# EAGLE design boardfix (EAGLE 9.6.0)
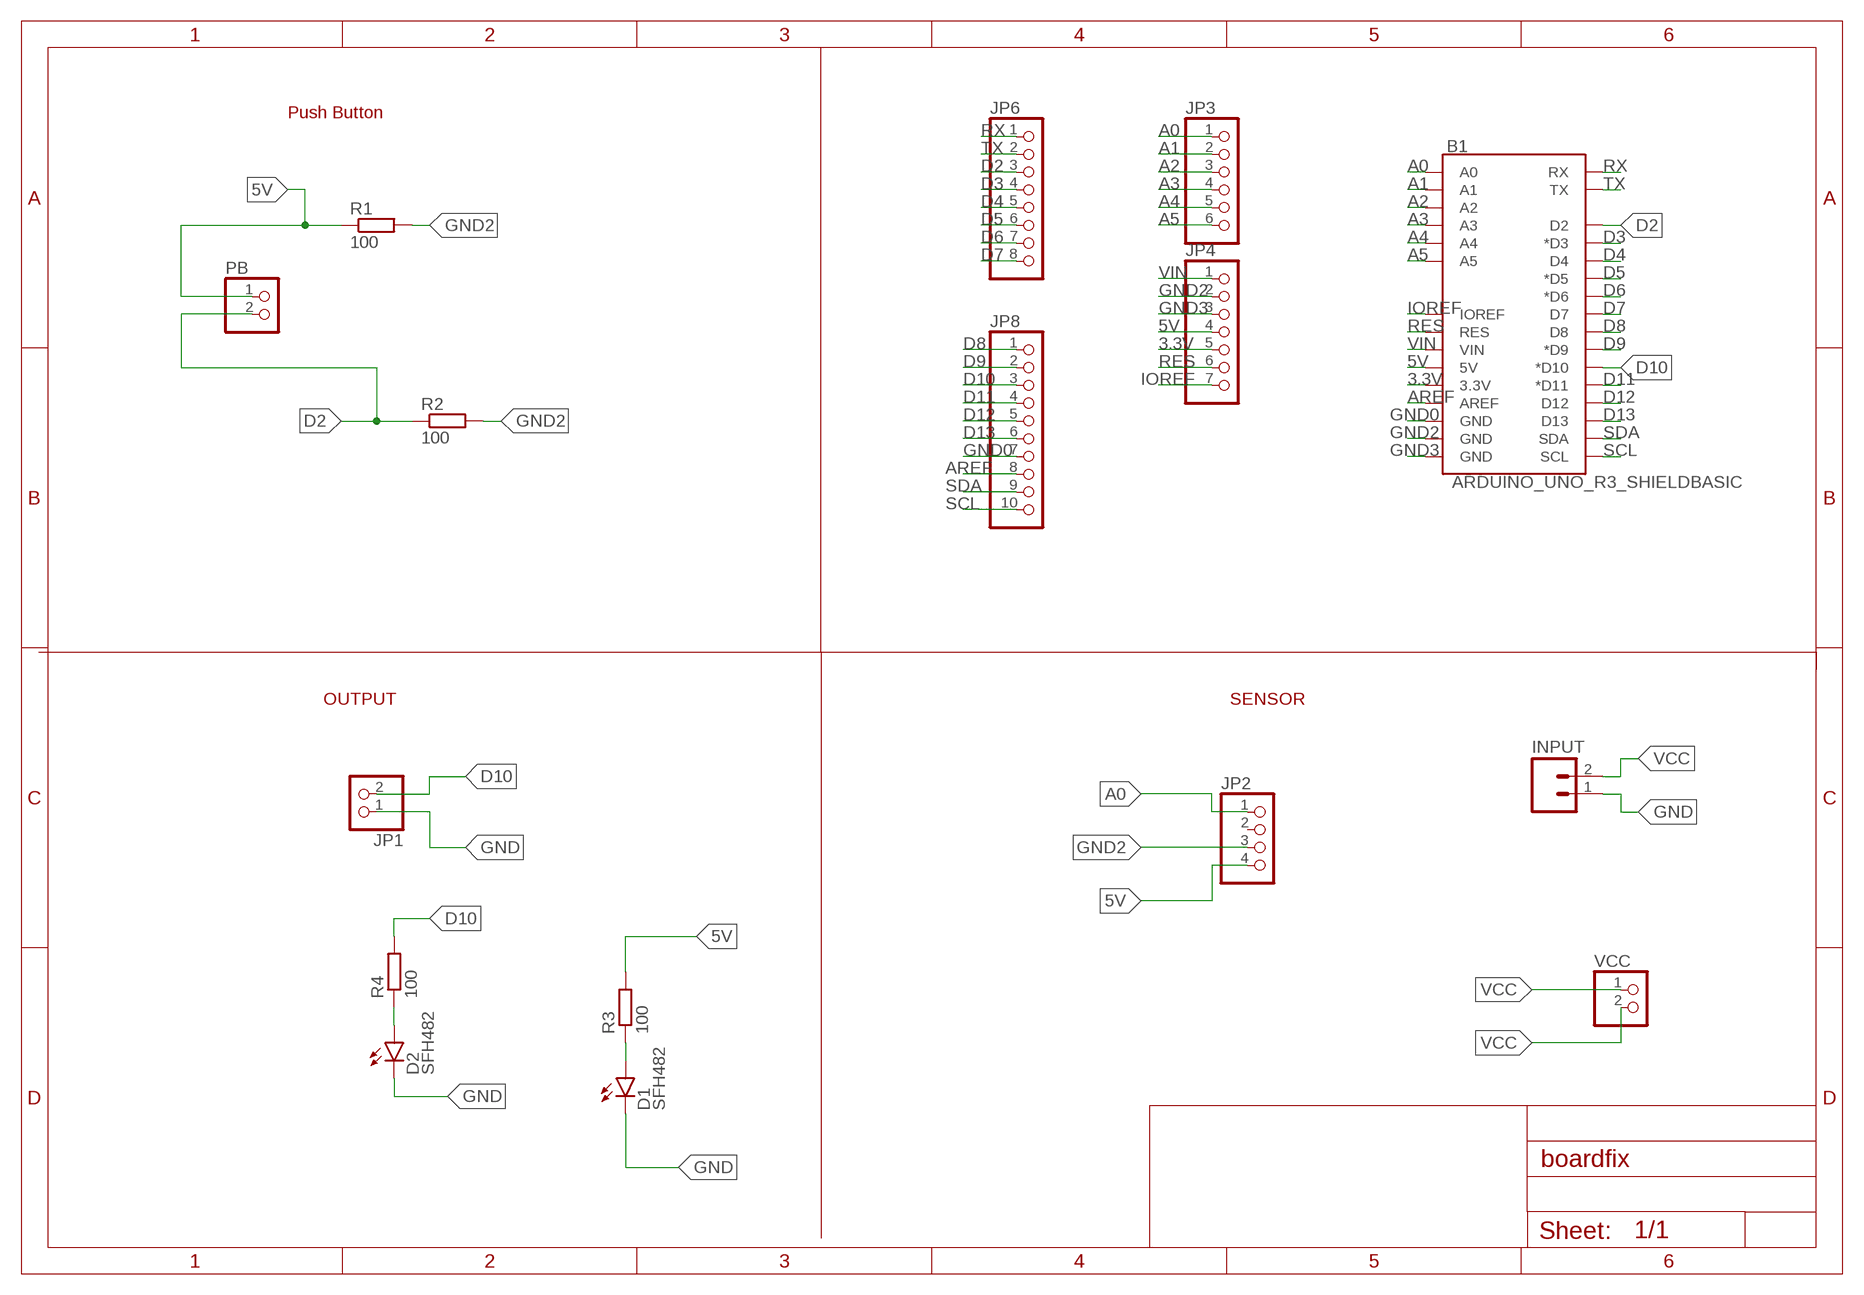
[diagram p0: schematic, sheet 1]

## Parts
B1  ARDUINO_UNO_R3_SHIELDBASIC  [UNO_R3_SHIELD]
D1  SFH482  [SFH482]
D2  SFH482  [SFH482]
INPUT  M02  [02P]
JP1  PINHD-1X2  [1X02]
JP2  PINHD-1X4  [1X04]
JP3  PINHD-1X6  [1X06]
JP4  PINHD-1X7  [1X07]
JP6  PINHD-1X8  [1X08]
JP8  PINHD-1X10  [1X10]
PB  PINHD-1X2  [1X02]
R1  100  R-EU_0207/7  [0207/7]
R2  100  R-EU_0207/7  [0207/7]
R3  100  R-EU_0207/7  [0207/7]
R4  100  R-EU_0207/7  [0207/7]
VCC  PINHD-1X2  [1X02]

## Nets
3.3V: B1.3.3V JP4.5
5V: B1.5V JP2.4 JP4.4 PB.1 R1.1 R3.2
A0: B1.A0 JP2.1 JP3.1
A1: B1.A1 JP3.2
A2: B1.A2 JP3.3
A3: B1.A3 JP3.4
A4: B1.A4 JP3.5
A5: B1.A5 JP3.6
AREF: B1.AREF JP8.8
D2: B1.D2 JP6.3 PB.2 R2.1
D3: B1.D3(*D3) JP6.4
D4: B1.D4 JP6.5
D5: B1.D5(*D5) JP6.6
D6: B1.D6(*D6) JP6.7
D7: B1.D7 JP6.8
D8: B1.D8 JP8.1
D9: B1.D9(*D9) JP8.2
D10: B1.D10(*D10) JP1.2 JP8.3 R4.2
D11: B1.D11(*D11) JP8.4
D12: B1.D12 JP8.5
D13: B1.D13 JP8.6
GND: D1.K(C) D2.K(C) INPUT.1 JP1.1
GND0: B1.GND@2(GND) JP8.7
GND2: B1.GND@1(GND) JP2.3 JP4.2 R1.2 R2.2
GND3: B1.GND@0(GND) JP4.3
IOREF: B1.IOREF JP4.7
N$2: D1.A R3.1
N$7: D2.A R4.1
RES: B1.RES JP4.6
RX: B1.RX JP6.1
SCL: B1.SCL JP8.10
SDA: B1.SDA JP8.9
TX: B1.TX JP6.2
VCC: INPUT.2 VCC.1 VCC.2
VIN: B1.VIN JP4.1
Unconnected: JP2.2

## Notes on the sheet
- Push Button
- OUTPUT | SENSOR

## Library data of the parts
B1 = SparkFun-Boards:ARDUINO_UNO_R3_SHIELD: Arduino R3 Shield Footprint Shield form compatible with the Arduino Uno R3. SparkFun Products: MG2639 Cellular Shield <https://www.sparkfun.com/products/13120> MIDI Shield <https://www.sparkfun.com/products/12898> R3 Stackable Headers Kit <https://www.sparkfun.com/products/11417>
D1 D2 = led:SFH482: IR LED infrared emitting diode, Infineon
INPUT = con-amp-quick:M02: AMP QUICK CONNECTOR; OC_FARNELL: unknown; OC_NEWARK: unknown
JP1 PB VCC = pinhead:PINHD-1X2: PIN HEADER
JP2 = pinhead:PINHD-1X4: PIN HEADER
JP3 = pinhead:PINHD-1X6: PIN HEADER
JP4 = pinhead:PINHD-1X7: PIN HEADER
JP6 = pinhead:PINHD-1X8: PIN HEADER
JP8 = pinhead:PINHD-1X10: PIN HEADER
R1-R4 = rcl:R-EU_: RESISTOR, European symbol; SPICEPREFIX: R

## Board
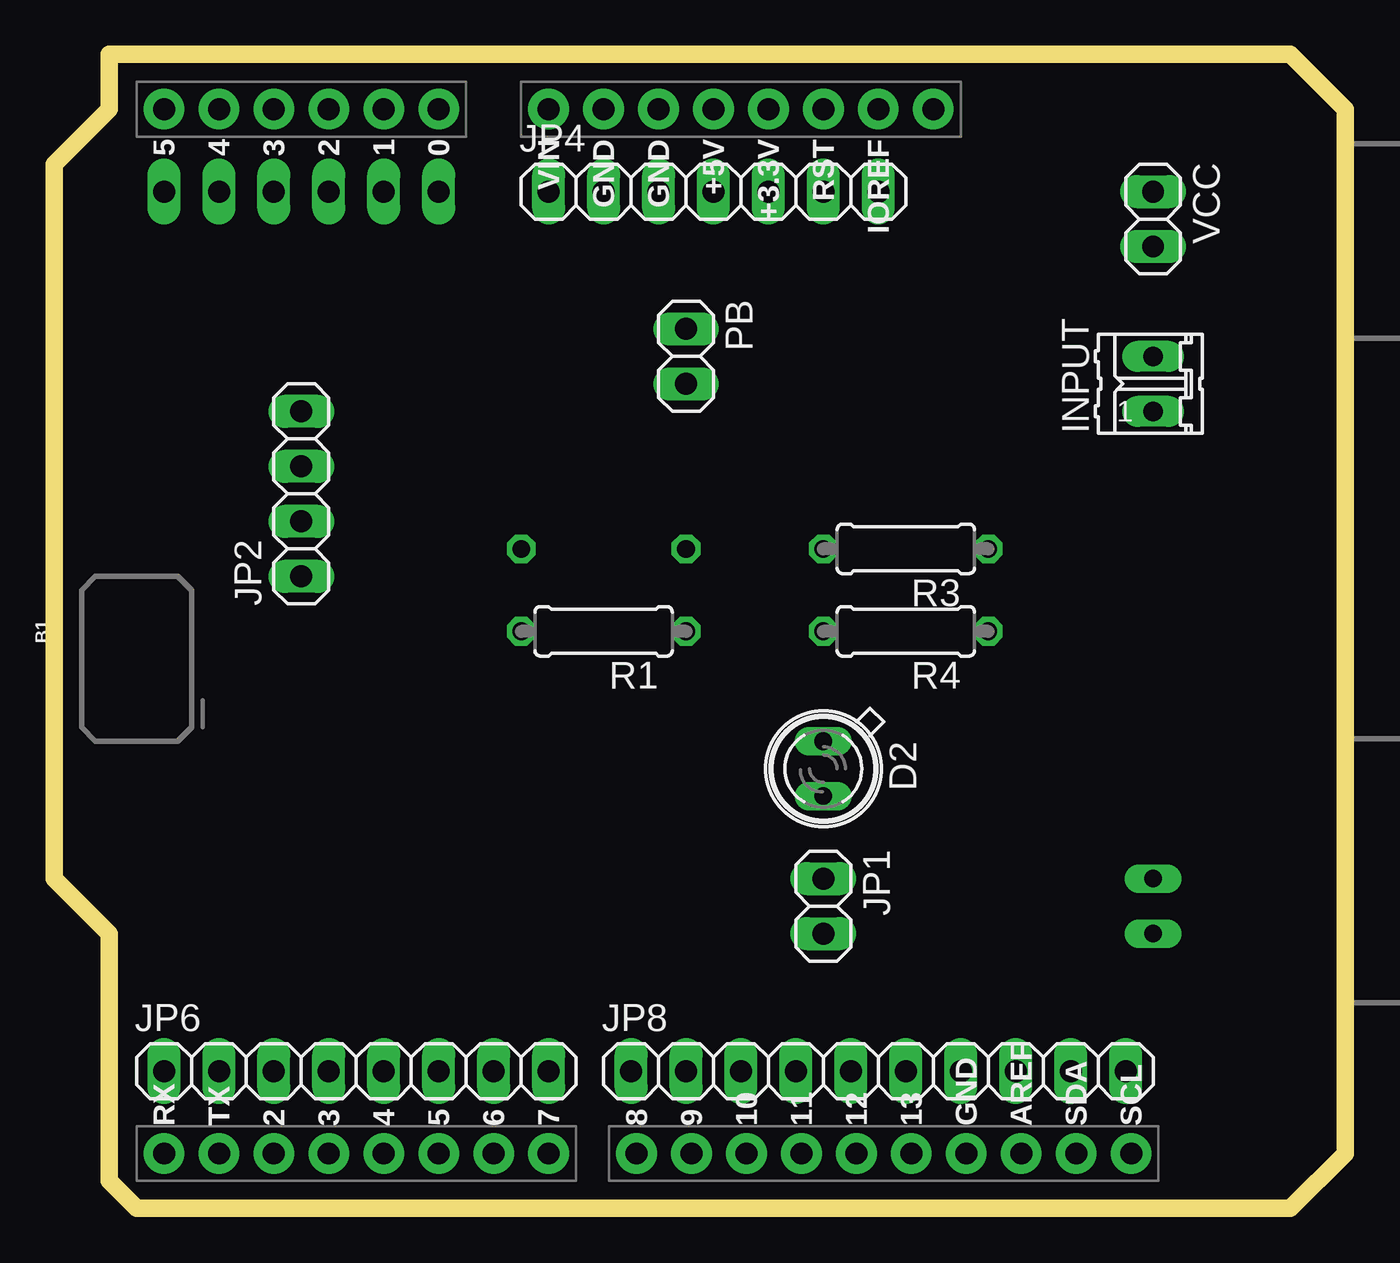
[diagram p1: board, top side]
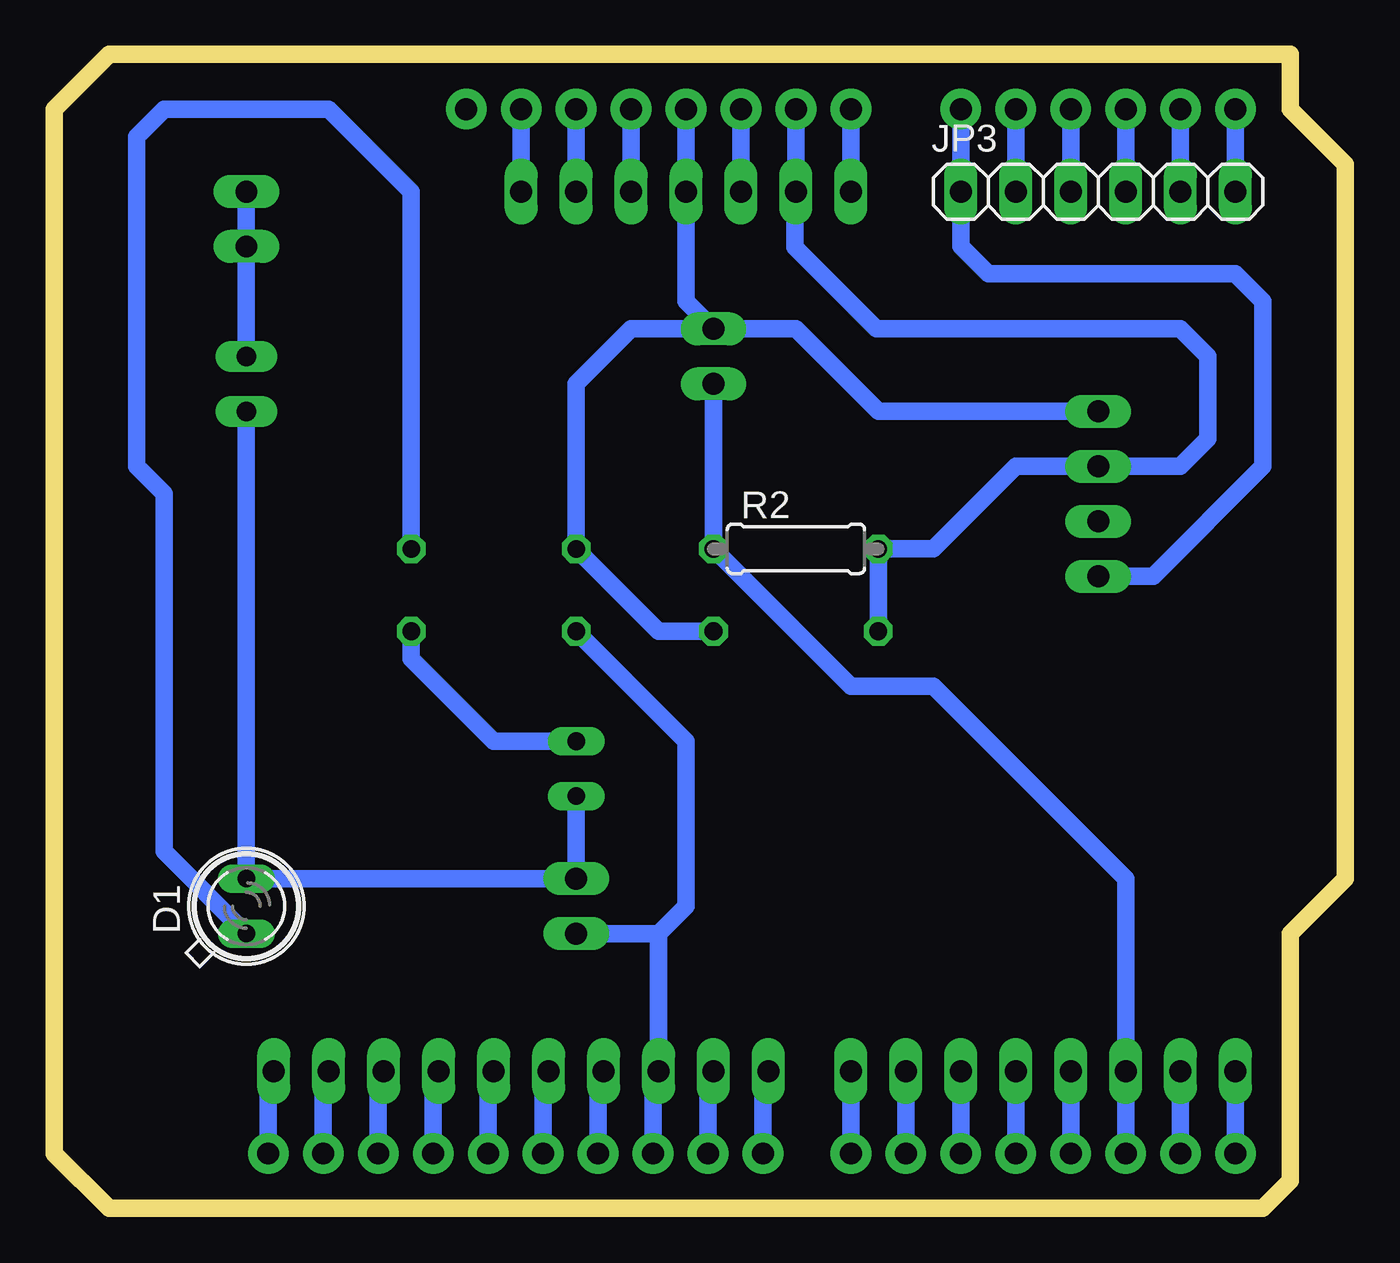
[diagram p2: board, bottom side, seen from below]

Size 59.69 x 53.34 mm. Coordinates in mm from the lower left corner, seen from the top.
Outline: 2.54,50.8 2.54,53.34 57.15,53.34 59.69,50.8 59.69,2.54 57.15,0 3.81,0 2.54,1.27 2.54,12.7 0,15.24 0,48.26 2.54,50.8
Copper layers (1*16): Top 0.035mm / dielectric 1.5mm / Bottom 0.035mm
Design rules "default": minimum track width 6mil, minimum drill 0.35mm, track to track 6mil, track to pad 6mil, pad to pad 6mil, via to via 6mil, smd to smd 6mil, copper to edge 40mil, drill to drill 6mil, minimum pad ring 10mil, minimum via ring 8mil, stop-mask expansion 4mil, vias tented up to drill 0mil, thermal gap 10mil

### Footprints (pad centres in the part's own frame; a part is rotated, then mirrored left to right if it is on the bottom)
UNO_R3_SHIELD = drill 1.016 pad 1.88: 3.3V 24.13,-2.54; 5V 24.13,0; A0 24.13,12.7; A1 24.13,15.24; A2 24.13,17.78; A3 24.13,20.32; A4 24.13,22.86; A5 24.13,25.4; AREF -24.13,-14.224; D2 -24.13,20.32; D3 -24.13,17.78; D4 -24.13,15.24; D5 -24.13,12.7; D6 -24.13,10.16; D7 -24.13,7.62; D8 -24.13,3.556; D9 -24.13,1.016; D10 -24.13,-1.524; D11 -24.13,-4.064; D12 -24.13,-6.604; D13 -24.13,-9.144; GND@0 24.13,2.54; GND@1 24.13,5.08; GND@2 -24.13,-11.684; IOREF 24.13,-7.62; NC 24.13,-10.16; RES 24.13,-5.08; RX -24.13,25.4; SCL -24.13,-19.304; SDA -24.13,-16.764; TX -24.13,22.86; VIN 24.13,7.62
SFH482 = drill 0.813 long: A -1.27,0; K 1.27,0
02P = drill 0.914 long: 1 -1.27,0; 2 1.27,0
1X02 = drill 1.016 long: 1 -1.27,0; 2 1.27,0
1X04 = drill 1.016 long: 1 -3.81,0; 2 -1.27,0; 3 1.27,0; 4 3.81,0
1X06 = drill 1.016 long: 1 -6.35,0; 2 -3.81,0; 3 -1.27,0; 4 1.27,0; 5 3.81,0; 6 6.35,0
1X07 = drill 1.016 long: 1 -7.62,0; 2 -5.08,0; 3 -2.54,0; 4 0,0; 5 2.54,0; 6 5.08,0; 7 7.62,0
1X08 = drill 1.016 long: 1 -8.89,0; 2 -6.35,0; 3 -3.81,0; 4 -1.27,0; 5 1.27,0; 6 3.81,0; 7 6.35,0; 8 8.89,0
1X10 = drill 1.016 long: 1 -11.43,0; 2 -8.89,0; 3 -6.35,0; 4 -3.81,0; 5 -1.27,0; 6 1.27,0; 7 3.81,0; 8 6.35,0; 9 8.89,0; 10 11.43,0
0207/7 = drill 0.813 octagon: 1 -3.81,0; 2 3.81,0

### Placement (x,y rotation side)
B1  30.48,26.67 90 top
D1  50.8,13.97 90 bottom
D2  35.56,20.32 270 top
INPUT  50.8,38.1 90 top
JP1  35.56,13.97 270 top
JP2  11.43,33.02 90 top
JP3  11.43,46.99 0 bottom
JP4  30.48,46.99 0 top
JP6  13.97,6.35 0 top
JP8  38.1,6.35 0 top
PB  29.21,39.37 270 top
R1  25.4,26.67 180 top
R2  25.4,30.48 0 bottom
R3  39.37,30.48 180 top
R4  39.37,26.67 180 top
VCC  50.8,45.72 270 top

### Tracks (layer width: path | path; a pad name or v marks a point on that pad's centre or on a via)
3.3V
  Bottom 0.813: JP4.5 B1.3.3V
5V
  Bottom 0.813: B1.5V JP4.4 30.48,41.91 PB.1 | PB.1 25.4,40.64 21.59,36.83 JP2.4 | R1.1 31.75,26.67 R3.2 35.56,38.1 33.02,40.64 PB.1
A0
  Bottom 0.813: B1.A0 JP3.1 17.78,44.45 16.51,43.18 5.08,43.18 3.81,41.91 3.81,34.29 8.89,29.21 JP2.1
A1
  Bottom 0.813: JP3.2 B1.A1
A2
  Bottom 0.813: JP3.3 B1.A2
A3
  Bottom 0.813: JP3.4 B1.A3
A4
  Bottom 0.813: JP3.5 B1.A4
A5
  Bottom 0.813: JP3.6 B1.A5
AREF
  Bottom 0.813: JP8.8 44.7,6.1 B1.AREF
D2
  Bottom 0.813: B1.D2 JP6.3 10.16,15.24 19.05,24.13 22.86,24.13 R2.1 PB.2
D3
  Bottom 0.813: JP6.4 B1.D3
D4
  Bottom 0.813: JP6.5 B1.D4
D5
  Bottom 0.813: JP6.6 B1.D5
D6
  Bottom 0.813: JP6.7 B1.D6
D7
  Bottom 0.813: JP6.8 B1.D7
D8
  Bottom 0.813: JP8.1 26.92,6.1 B1.D8
D9
  Bottom 0.813: JP8.2 29.46,6.1 B1.D9
D10
  Bottom 0.813: B1.D10 32,6.1 JP8.3 31.75,12.7 | R4.2 30.48,21.59 30.48,13.97 31.75,12.7 | JP1.2 31.75,12.7
D11
  Bottom 0.813: JP8.4 34.54,6.1 B1.D11
D12
  Bottom 0.813: JP8.5 37.08,6.1 B1.D12
D13
  Bottom 0.813: JP8.6 39.62,6.1 B1.D13
GND
  Bottom 0.813: D2.K JP1.1 D1.K INPUT.1
GND0
  Bottom 0.813: JP8.7 42.16,6.1 B1.GND@2
GND2
  Bottom 0.813: B1.GND@1 JP4.2 25.45,46.94 25.45,44.41 21.68,40.64 7.62,40.64 6.35,39.37 6.35,35.56 7.62,34.29 JP2.3 | 10.16,34.29 JP2.3 | JP2.3 15.24,34.29 19.05,30.48 R2.2 R1.2
GND3
  Bottom 0.813: JP4.3 B1.GND@0
IOREF
  Bottom 0.813: JP4.7 B1.IOREF
N$2
  Bottom 0.813: D1.A 54.61,16.51 54.61,33.02 55.88,34.29 55.88,49.53 54.61,50.8 46.99,50.8 43.18,46.99 R3.1
N$7
  Bottom 0.813: D2.A 39.37,21.59 43.18,25.4 R4.1
RES
  Bottom 0.813: JP4.6 B1.RES
RX
  Bottom 0.813: JP6.1 B1.RX
SCL
  Bottom 0.813: JP8.10 49.78,6.1 B1.SCL
SDA
  Bottom 0.813: JP8.9 47.24,6.1 B1.SDA
TX
  Bottom 0.813: JP6.2 B1.TX
VCC
  Bottom 0.813: VCC.1 VCC.2 INPUT.2
VIN
  Bottom 0.813: JP4.1 B1.VIN